# EasyEDA schematic 1-Schematic_STM32PCB.json
TITLE: Sheet_1; REV: 1.0; Date: 2019-02-28; Sheet: 1/1; Drawn By: rupin.chheda; Company: Your Company
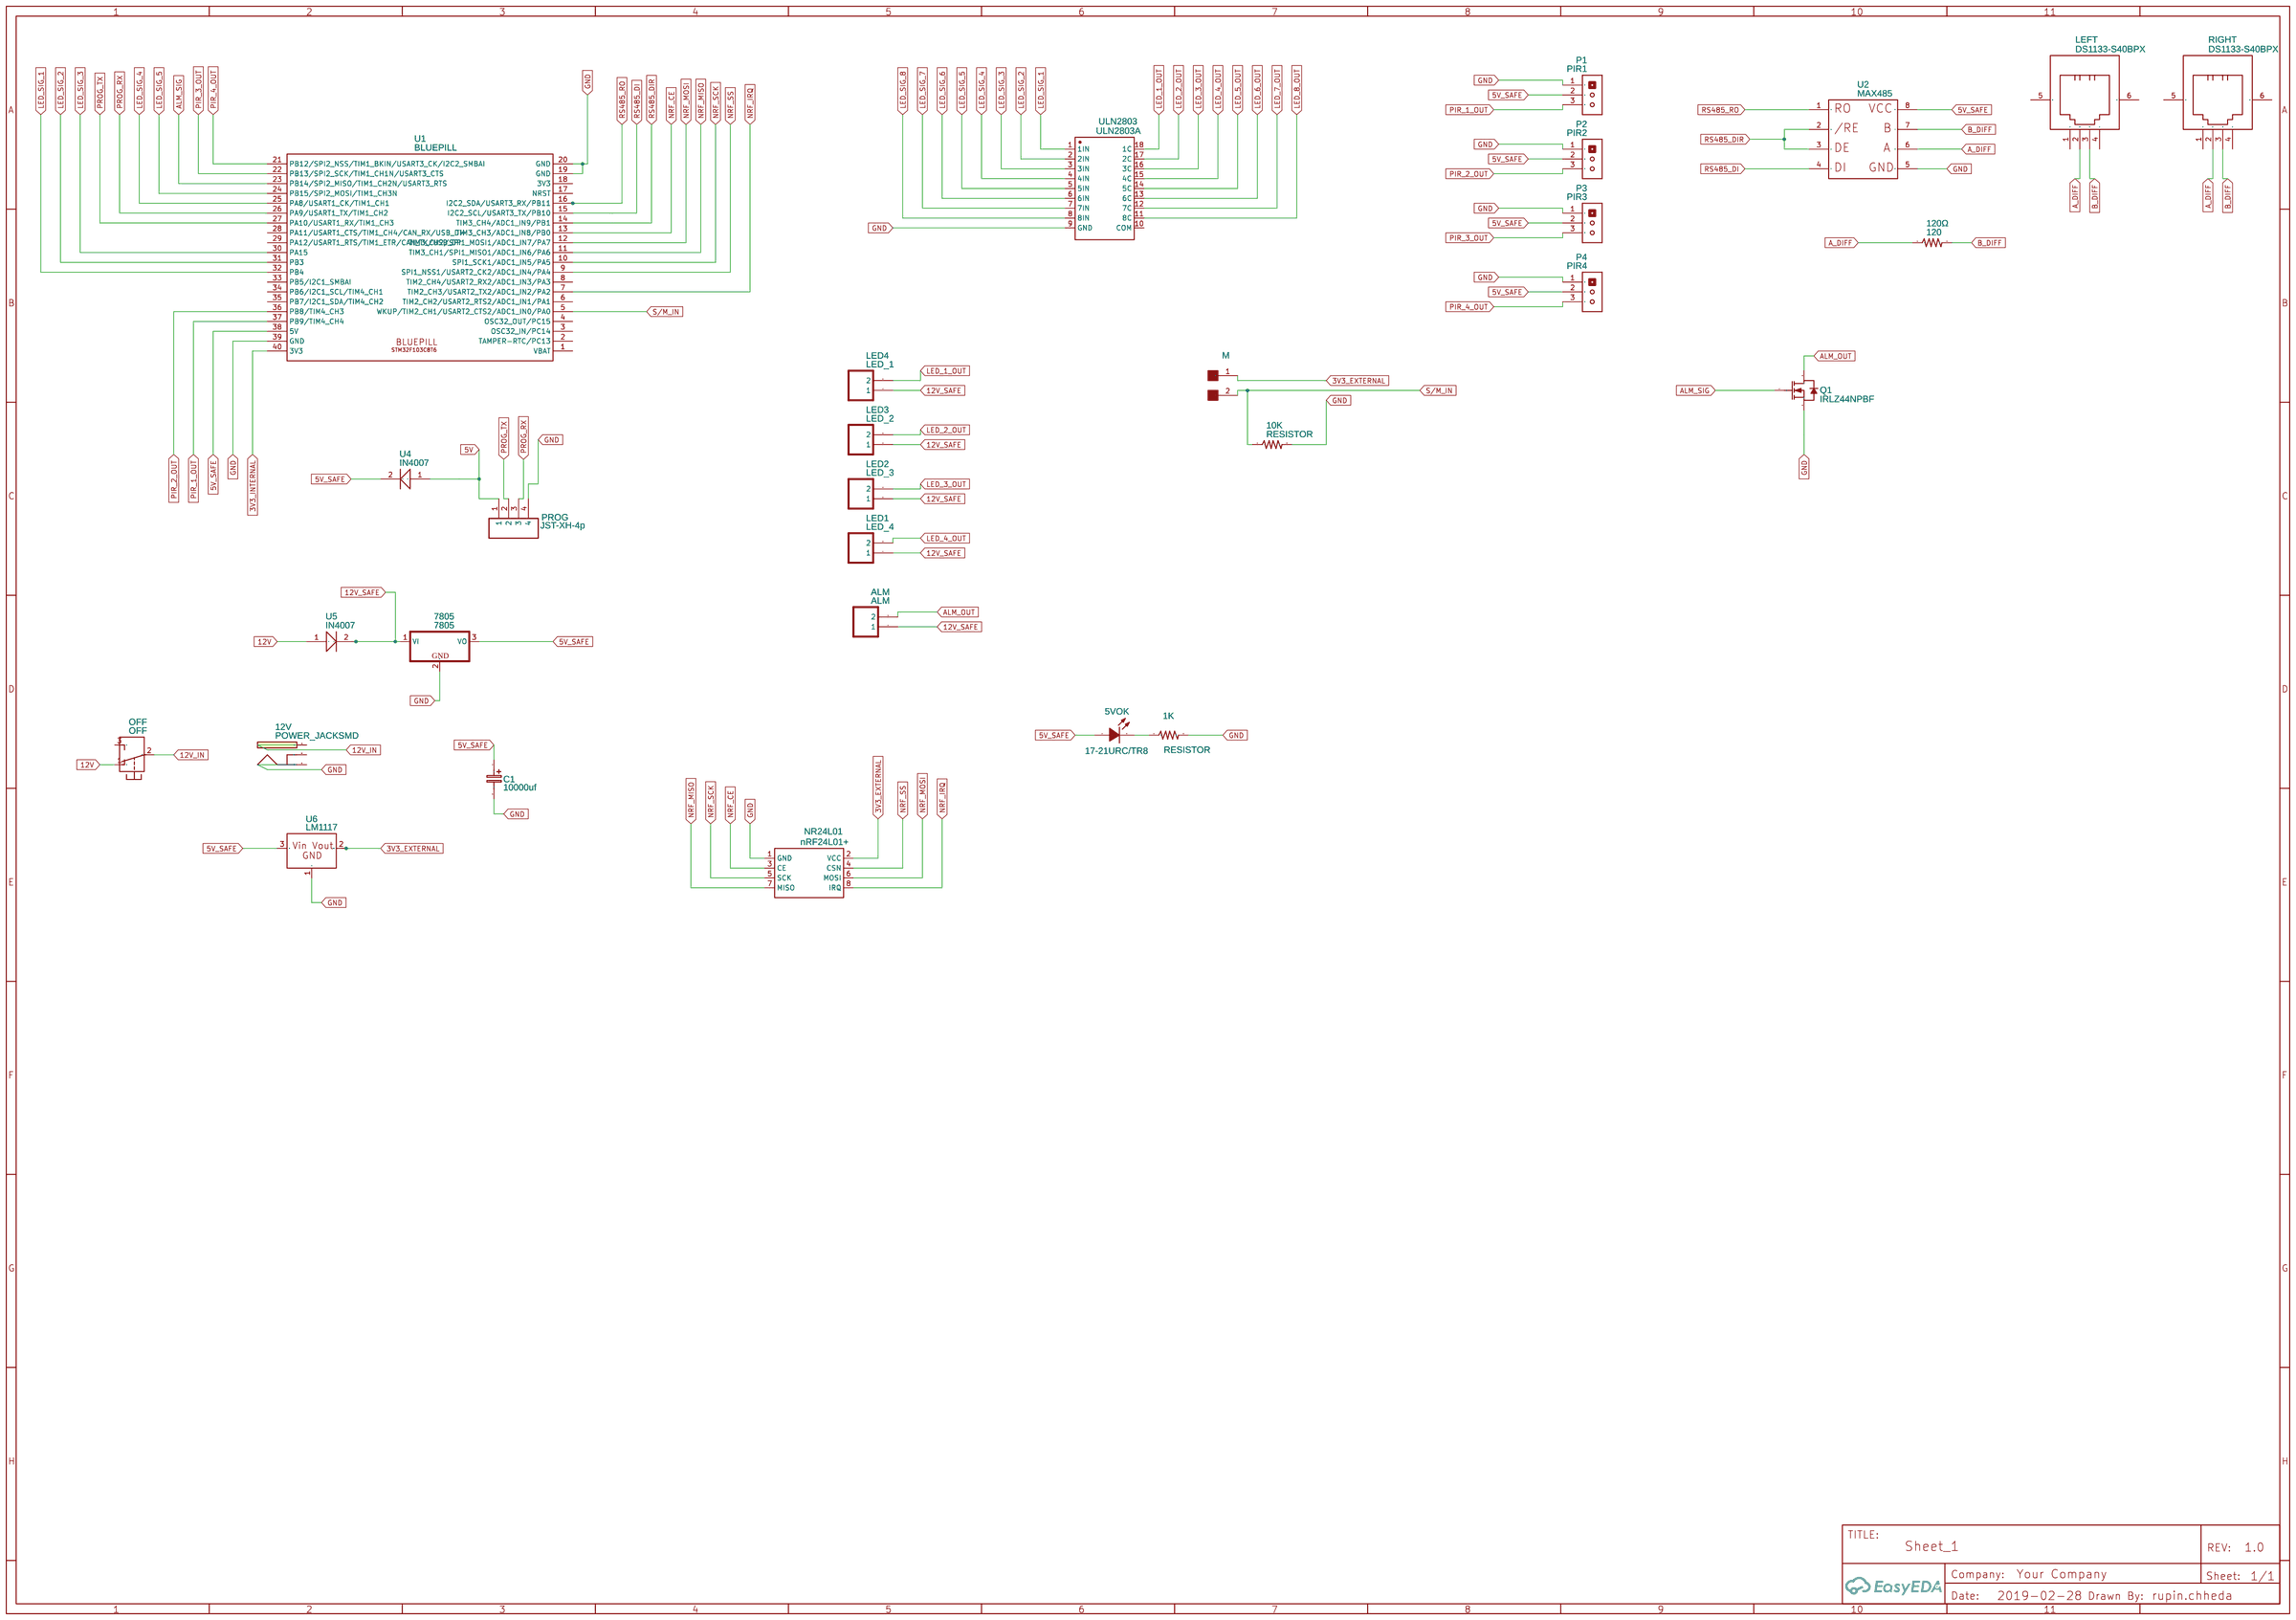
[diagram p0: schematic sheet]

## Parts
1K  RESISTOR  [0805]
5VOK  17-21URC/TR8  [LED-0805]
10K  RESISTOR  [0805]
12V  POWER_JACKSMD  [POWER_JACK_SMD]
120Ω  120  [0805]
7805  7805  [TO_220_OK]
ALM  ALM  [JST-2-PTH 2.54MM]
C1  10000uf  [CP_8X13MM]
LED1  LED_4  [JST-2-PTH 2.54MM]
LED2  LED_3  [JST-2-PTH 2.54MM]
LED3  LED_2  [JST-2-PTH 2.54MM]
LED4  LED_1  [JST-2-PTH 2.54MM]
LEFT  DS1133-S40BPX  [RJ11-1]
M  Jumper 1x2 75mil square  [JUMPER 1X2 (SMD)]
NR24L01  nRF24L01+  [HDR IDC 2X4P]
OFF  OFF  [EG1206]
P1  PIR1  [JST-3-SMD 2.54MM]
P2  PIR2  [JST-3-SMD 2.54MM]
P3  PIR3  [JST-3-SMD 2.54MM]
P4  PIR4  [JST-3-SMD 2.54MM]
PROG  JST-XH-4p  [SMD JST XH 1 X 4 2.54MM PITCH]
Q1  IRLZ44NPBF  [TO-220(TO-220-3)]
RIGHT  DS1133-S40BPX  [RJ11-1]
U1  BLUEPILL  [BLUEPILL]
U2  MAX485  [DIP8]
U4  IN4007  [SMA(DO-214AC)-BIG]
U5  IN4007  [SMA(DO-214AC)-BIG]
U6  LM1117  [SOT-223]
ULN2803  ULN2803A  [DIP-18]

## Library data of the parts
1K 10K = -: Contributor: SparkFun; Manufacturer Part: ?
5VOK = -: Supplier: LCSC; Supplier Part: C264414; Manufacturer: Everlight Elec; Contributor: LCSC
12V = -: Power Jack; Contributor: SparkFun; Manufacturer Part: ?
120Ω = -: null; Manufacturer Part: ?
7805 = -: Contributor: Adafruit; Manufacturer Part: ?
ALM LED1-LED4 = -: sourceId: Y4gQNLJH3; Supplier Part: 455-2257-ND; Supplier: Digi-Key; Contributor: louloumc; Manufacturer Part: ?
C1 = Electrolytic_Capacitor: sourceId: vUOI0UcuM; Manufacturer Part: ?
LEFT RIGHT = -: Supplier: LCSC; Manufacturer: CONNFLY; Supplier Part: C77856
M = -: Contributor: terry8345
NR24L01 = -: Manufacturer Part: ?; Contributor: cpu76239
OFF = -: Contributor: Samuel B; Manufacturer Part: ?
P1-P4 = -: sourceId: Y4gQNLJH3; Supplier Part: undefined; Supplier: Digi-Key; Contributor: OneBlockEngineering; Manufacturer Part: ?
PROG = -: Supplier Part: C5663; Supplier: LCSC; Digi-Key: 455-2271-ND; Contributor: Ftec; Manufacturer Part: ?
Q1 = -: Supplier: LCSC; Manufacturer: IR; Supplier Part: C38774
U1 = -: Manufacturer Part: ?; Supplier Part: undefined; Contributor: rom1nux
U2 = -: Contributor: cc_CGB; Supplier Part: 251-9431; Supplier: Element14; link: http://www.farnell.com/datasheets/1700964.pdf?_ga=2.187406186.33919013.1528380950-258607356.1495180379
U4 U5 = -: Contributor: Subrikman
U6 = -: Contributor: KiCad; Manufacturer Part: ?
ULN2803 = -: Supplier: LCSC; Manufacturer: STMicroelectronics; Supplier Part: C73936

## Nets
3V3_EXTERNAL: M.1 NR24L01.2(VCC) U6.2(Vout)
3V3_INTERNAL: U1.40(3V3)
5V: PROG.1 U4.1(A)
5V_SAFE: 5VOK.1(A) 7805.3(VO) C1.1 P1.2 P2.2 P3.2 P4.2 U1.38(5V) U2.8 U4.2(K) U6.3(Vin)
12V: OFF.1(O) U5.1(A)
12V_IN: 12V.VIN0(PWR) OFF.2(P)
12V_SAFE: 7805.1(VI) ALM.1 LED1.1 LED2.1 LED3.1 LED4.1 U5.2(K)
GND: 1K.2 10K.2 12V.P$4(GND) 7805.2(GND) C1.2 NR24L01.1(GND) P1.1 P2.1 P3.1 P4.1 PROG.4 Q1.3(S) U1.19(GND) U1.20(GND) U1.39(GND) U2.5 U6.1(Vin) ULN2803.9(GND)
A_DIFF: 120Ω.1 LEFT.2 RIGHT.2 U2.6
ALM_OUT: ALM.2 Q1.2(D)
ALM_SIG: Q1.1(G) U1.23(PB14/SPI2_MISO/TIM1_CH2N/USART3_RTS)
B_DIFF: 120Ω.2 LEFT.3 RIGHT.3 U2.7
LED_1_OUT: LED4.2 ULN2803.18(1C)
LED_2_OUT: LED3.2 ULN2803.17(2C)
LED_3_OUT: LED2.2 ULN2803.16(3C)
LED_4_OUT: LED1.2 ULN2803.15(4C)
LED_5_OUT: ULN2803.14(5C)
LED_6_OUT: ULN2803.13(6C)
LED_7_OUT: ULN2803.12(7C)
LED_8_OUT: ULN2803.11(8C)
LED_SIG_1: U1.32(PB4) ULN2803.1(1IN)
LED_SIG_2: U1.31(PB3) ULN2803.2(2IN)
LED_SIG_3: U1.30(PA15) ULN2803.3(3IN)
LED_SIG_4: U1.25(PA8/USART1_CK/TIM1_CH1) ULN2803.4(4IN)
LED_SIG_5: U1.24(PB15/SPI2_MOSI/TIM1_CH3N) ULN2803.5(5IN)
LED_SIG_6: ULN2803.6(6IN)
LED_SIG_7: ULN2803.7(7IN)
LED_SIG_8: ULN2803.8(8IN)
NRF_CE: NR24L01.3(CE) U1.13(TIM3_CH3/ADC1_IN8/PB0)
NRF_IRQ: NR24L01.8(IRQ) U1.7(TIM2_CH3/USART2_TX2/ADC1_IN2/PA2)
NRF_MISO: NR24L01.7(MISO) U1.11(TIM3_CH1/SPI1_MISO1/ADC1_IN6/PA6)
NRF_MOSI: NR24L01.6(MOSI) U1.12(TIM3_CH2/SPI1_MOSI1/ADC1_IN7/PA7)
NRF_SCK: NR24L01.5(SCK) U1.10(SPI1_SCK1/ADC1_IN5/PA5)
NRF_SS: NR24L01.4(CSN) U1.9(SPI1_NSS1/USART2_CK2/ADC1_IN4/PA4)
PIR_1_OUT: P1.3 U1.37(PB9/TIM4_CH4)
PIR_2_OUT: P2.3 U1.36(PB8/TIM4_CH3)
PIR_3_OUT: P3.3 U1.22(PB13/SPI2_SCK/TIM1_CH1N/USART3_CTS)
PIR_4_OUT: P4.3 U1.21(PB12/SPI2_NSS/TIM1_BKIN/USART3_CK/I2C2_SMBAI)
PROG_RX: PROG.3 U1.26(PA9/USART1_TX/TIM1_CH2)
PROG_TX: PROG.2 U1.27(PA10/USART1_RX/TIM1_CH3)
RS485_DI: U1.15(I2C2_SCL/USART3_TX/PB10) U2.4
RS485_DIR: U1.14(TIM3_CH4/ADC1_IN9/PB1) U2.2 U2.3
RS485_RO: U1.16(I2C2_SDA/USART3_RX/PB11) U2.1
S/M_IN: 10K.1 M.2 U1.5(WKUP/TIM2_CH1/USART2_CTS2/ADC1_IN0/PA0)
5VOK_2: 1K.1 5VOK.2(K)

Not connected (* = marked no-connect by the designer): 12V GND(GNDBREAK); LEFT 1 4 5 6; OFF 3(S); RIGHT 1 4 5 6; U1 1(VBAT) 2(TAMPER-RTC/PC13) 3(OSC32_IN/PC14) 4(OSC32_OUT/PC15) 6(TIM2_CH2/USART2_RTS2/ADC1_IN1/PA1) 8(TIM2_CH4/USART2_RX2/ADC1_IN3/PA3) 17(NRST) 18(3V3) 28(PA11/USART1_CTS/TIM1_CH4/CAN_RX/USB_DM) 29(PA12/USART1_RTS/TIM1_ETR/CAN_TX/USB_DP) 33(PB5/I2C1_SMBAI) 34(PB6/I2C1_SCL/TIM4_CH1) 35(PB7/I2C1_SDA/TIM4_CH2); ULN2803 10(COM)
